# Altium project BUNE.PrjPcb
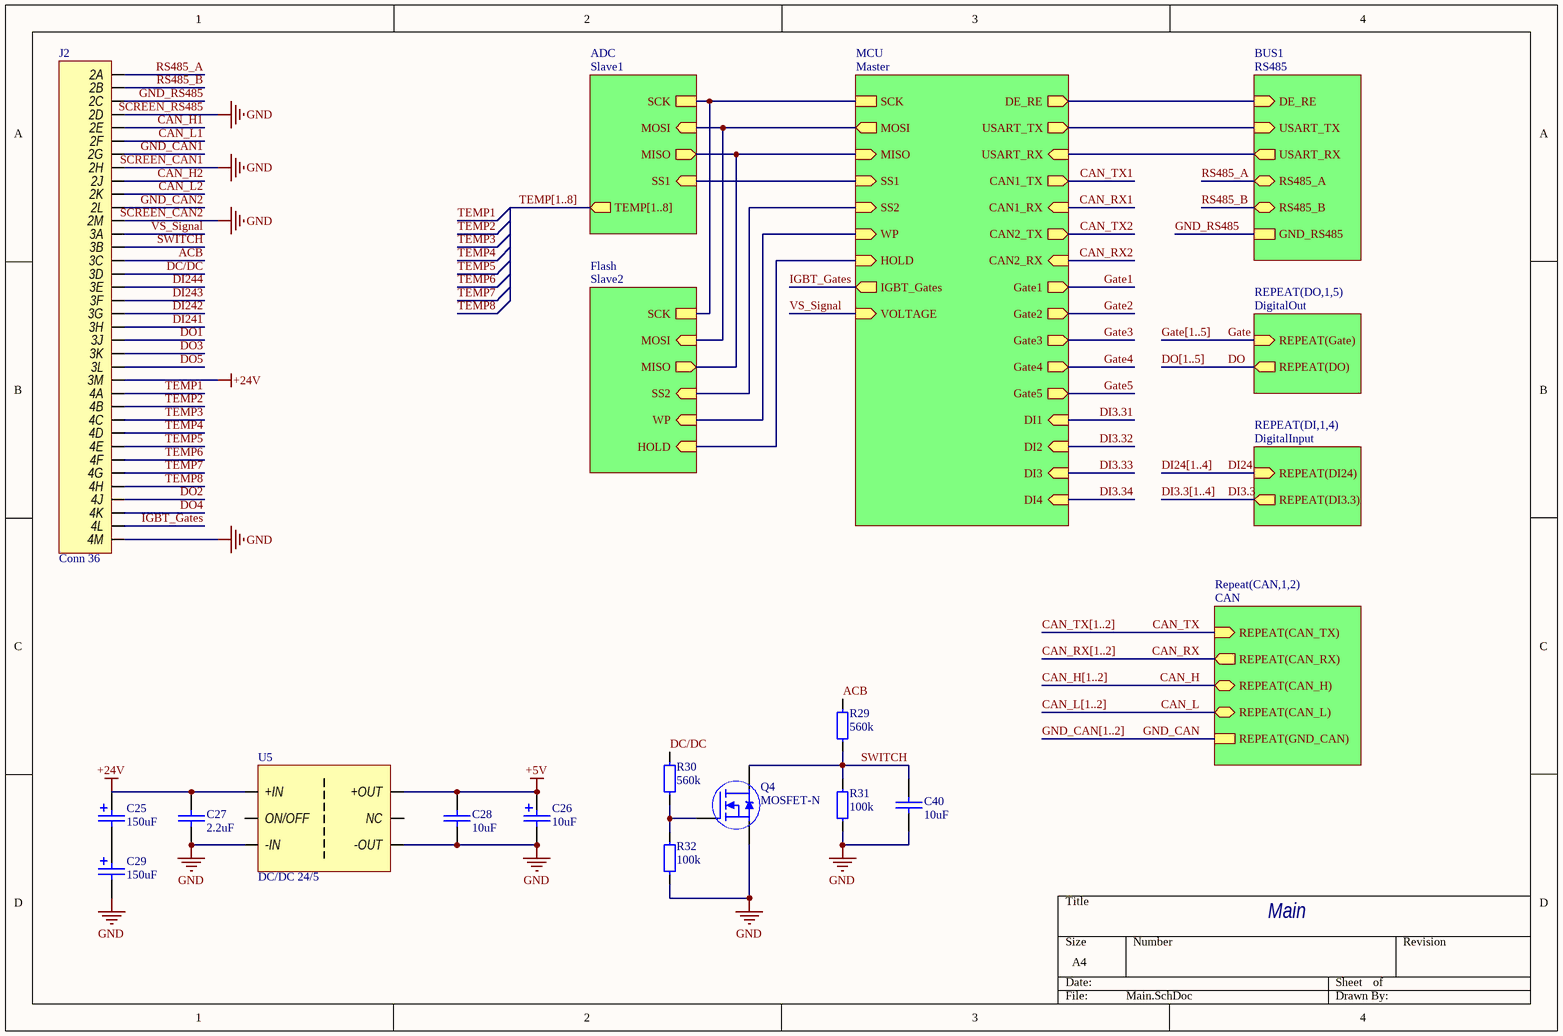
[diagram p0: Main.SchDoc]
8 sheets, 139 parts. Net scope: hierarchical (ports join the sheet entries above them; power ports are global).
Board file: BUNE.PcbDoc
Sheets:
  Main.SchDoc
    MCU = Master.SchDoc
    BUS1 = RS485.SchDoc
    CAN1 = CAN.SchDoc
    CAN2 = CAN.SchDoc
    ADC = Slave1.SchDoc
    Flash = Slave2.SchDoc
    DO1 = DigitalOut.SchDoc
    DO2 = DigitalOut.SchDoc
    DO3 = DigitalOut.SchDoc
    DO4 = DigitalOut.SchDoc
    DO5 = DigitalOut.SchDoc
    DI1 = DigitalInput.SchDoc
    DI2 = DigitalInput.SchDoc
    DI3 = DigitalInput.SchDoc
    DI4 = DigitalInput.SchDoc

## Sheet Main.SchDoc
size A4; SheetNumber: 1; SheetTotal: 8

### Parts
C25  150uF  [TANTAL_D_CASE]
C26  10uF  [TANTAL_C_CASE]
C27  2.2uF  [0603 Capicator]
C28  10uF  [0603 Capicator]
C29  150uF  [TANTAL_D_CASE]
C40  10uF  [0603 Capicator]
J2  Conn 36  [Molex_477320361]
Q4  MOSFET-N  [SOT-23]
R29  560k  [0603 Resistor]
R30  560k  [0603 Resistor]
R31  100k  [0603 Resistor]
R32  100k  [0603 Resistor]
U5  DC/DC 24/5  [VDRI10(6)]

### Sub-sheets
ADC = Slave1: TEMP[1..8] (out), MISO (out), SS1 (in), MOSI (in), SCK
BUS1 = RS485: USART_TX (in), USART_RX (out), DE_RE (in), RS485_A (bidir), RS485_B (bidir), GND_RS485
Flash = Slave2: MISO (out), SS2 (in), MOSI (in), SCK, WP (in), HOLD (in)
MCU = Master: DE_RE (out), USART_TX (out), USART_RX (in), CAN1_TX (out), CAN1_RX (in), CAN2_TX (out), CAN2_RX (in), VOLTAGE (in), IGBT_Gates (out), MISO (in), MOSI (out), SCK, WP (in), HOLD (in), SS1 (in), SS2 (in), Gate1 (out), Gate2 (out), Gate3 (out), Gate4 (out), Gate5 (out), DI1 (in), DI2 (in), DI3 (in), DI4 (in)
Repeat(CAN,1,2) = CAN: REPEAT(CAN_TX) (in), REPEAT(CAN_RX) (out), REPEAT(CAN_H) (bidir), REPEAT(CAN_L) (bidir), REPEAT(GND_CAN)
REPEAT(DI,1,4) = DigitalInput: REPEAT(DI24) (in), REPEAT(DI3.3) (out)
REPEAT(DO,1,5) = DigitalOut: REPEAT(Gate) (in), REPEAT(DO) (out)

### Nets
+5V: C26.2 C28.2 U5.9(+OUT)
+24V: C25.2 C27.2 J2.3M U5.16(+IN)
GND: C26.1 C27.1 C28.1 C29.1 C40.1 J2.2D J2.2H J2.2M J2.4M Q4.2(Source) R31.1 R32.1 U5.1(-IN) U5.10(-OUT)
ACB: J2.3C R29.2
CAN_H: sheet Repeat(CAN,1,2)/REPEAT(CAN_H)
CAN_H1: J2.2E
CAN_H2: J2.2J
CAN_L: sheet Repeat(CAN,1,2)/REPEAT(CAN_L)
CAN_L1: J2.2F
CAN_L2: J2.2K
CAN_RX: sheet Repeat(CAN,1,2)/REPEAT(CAN_RX)
CAN_TX: sheet Repeat(CAN,1,2)/REPEAT(CAN_TX)
DC/DC: J2.3D R30.2
DI3.3: sheet REPEAT(DI,1,4)/REPEAT(DI3.3)
DI24: sheet REPEAT(DI,1,4)/REPEAT(DI24)
DI241: J2.3H
DI242: J2.3G
DI243: J2.3F
DI244: J2.3E
DO: sheet REPEAT(DO,1,5)/REPEAT(DO)
DO1: J2.3J
DO2: J2.4J
DO3: J2.3K
DO4: J2.4K
DO5: J2.3L
Gate: sheet REPEAT(DO,1,5)/REPEAT(Gate)
GND_CAN: sheet Repeat(CAN,1,2)/REPEAT(GND_CAN)
GND_CAN1: J2.2G  [project net GND_CAN]
GND_CAN2: J2.2L  [project net GND_CAN]
GND_RS485: J2.2C ; sheet BUS1/GND_RS485
IGBT_Gates: J2.4L ; sheet MCU/IGBT_Gates
MISO: sheet MCU/MISO, sheet ADC/MISO, sheet Flash/MISO
MOSI: sheet MCU/MOSI, sheet ADC/MOSI, sheet Flash/MOSI
RS485_A: J2.2A ; sheet BUS1/RS485_A
RS485_B: J2.2B ; sheet BUS1/RS485_B
SCK: sheet MCU/SCK, sheet ADC/SCK, sheet Flash/SCK
SS1: sheet MCU/SS1, sheet ADC/SS1
SS2: sheet MCU/SS2, sheet Flash/SS2
SWITCH: C40.2 J2.3B Q4.3(Drain) R29.1 R31.2
TEMP1: J2.4A
TEMP2: J2.4B
TEMP3: J2.4C
TEMP4: J2.4D
TEMP5: J2.4E
TEMP6: J2.4F
TEMP7: J2.4G
TEMP8: J2.4H
VS_Signal: J2.3A ; sheet MCU/VOLTAGE
NetC25_1: C25.1 C29.2
NetQ4_1: Q4.1(Gate) R30.1 R32.2
NetU1_24: sheet MCU/WP, sheet Flash/WP
NetU1_25: sheet MCU/HOLD, sheet Flash/HOLD
NetU1_41: sheet MCU/DE_RE, sheet BUS1/DE_RE
NetU1_42: sheet MCU/USART_TX, sheet BUS1/USART_TX
NetU1_43: sheet MCU/USART_RX, sheet BUS1/USART_RX

Not connected (* = marked no-connect by the designer): U5 2(ON/OFF) 8(NC)

### Buses and harness runs
bus CAN_H[1..2]
bus CAN_L[1..2]
bus CAN_RX[1..2]
bus CAN_TX[1..2]
bus DI3.3[1..4]
bus DI24[1..4]
bus DO[1..5]
bus Gate[1..5]
bus GND_CAN[1..2]
bus TEMP[1..8] = sheet ADC/TEMP[1..8]

### Notes on the sheet
- (near J2) SCREEN_RS485
- (near J2) SCREEN_CAN1
- (near J2) SCREEN_CAN2
- Main

### Library data of the parts
C25 C29 = Cap Tantal 150uF (SMDD): TECAP, 150uF, 16V, case D, 10%; Part Number: 293D157X9010D2TE3; Manufacturer: Vishay; Type: Capacitor; ComponentLink1Description: Chip&Dip; ComponentLink1URL: https://www.chipdip.ru/product0/8018239339
C26 = Cap Tantal 10uF (SMDC): TECAP, 10uF, 35V, case C, 10%; Part Number: TECAP10/35VC10; Manufacturer: China; Type: Capacitor; ComponentLink1Description: Chip&Dip; ComponentLink1URL: https://www.chipdip.ru/product/tecap-10-mkf-35-v-tip-c-10
C27 = Cap 2.2uF (0603): 2.2uF X5R 50V 10% 0603; Manufacturer: Murata Manufacturing; Part Number: GRM188R61H225KE11D; Type: Capacitor; ComponentLink1Description: Chip&Dip; ComponentLink1URL: https://www.chipdip.ru/product/grm188r61h225ke11d-murata
C28 C40 = Cap 10uF (0603): 10uF X5R 25V 20% 0603; Manufacturer: Murata Manufacturing; Part Number: GRM188R61E106M; Type: Capacitor; ComponentLink1Description: Chip&Dip; ComponentLink1URL: https://www.chipdip.ru/product/grm188r61e106m
J2 = Conn 36 (Molex): Molec 36 pin PCB Header 477320361; Manufacturer: Molex; Type: Connector; Part Number: 477320361; ComponentLink1Description: ChipDip; ComponentLink1URL: https://www.chipdip.ru/product0/8004298252; ComponentLink2Description: Promelec; ComponentLink2URL: https://www.promelec.ru/product/427663/; ComponentLink3Description: Datasheet; ComponentLink3URL: https://static.chipdip.ru/lib/848/DOC011848025.pdf
Q4 = MOSFET-N [IRLML]: VDS 30V,  VGS Max ± 20V, RDS 27-40mΩ,; Part Number: IRLML0030TRPBF; Manufacturer: Infineon Technologies; Type: Transistor; ComponentLink1Description: DataSheet; ComponentLink1URL: https://static.chipdip.ru/lib/300/DOC000300382.pdf; ComponentLink2Description: Chip&Dip; ComponentLink2URL: https://www.chipdip.ru/product/irlml0030trpbf
R29 R30 = Res 560k (0603): 0.1W 0603 560k, 1%; Part Number: RC0603FR-07560KL; Manufacturer: Taiwan; Type: Resistor; ComponentLink1Description: Chip&Dip; ComponentLink1URL: https://www.chipdip.ru/product0/9000079778
R31 R32 = Res 100k (0603): 0.1W 0603 100k, 1%; Part Number: RC0603FR-07100KL; Manufacturer: Taiwan; Type: Resistor; ComponentLink1Description: Chip&Dip; ComponentLink1URL: https://www.chipdip.ru/product0/9000079760
U5 = VDRI10B05: DC/DC converter 24/5 10W; Manufacturer: Voltbricks; Part Number: VDRI10B05; Type: IC; ComponentLink2Description: Datasheet; ComponentLink2URL: https://support.voltbricks.ru/datasheets/VDRI10.pdf?1689593019

## Sheet Master.SchDoc
size A4; SheetNumber: 2; SheetTotal: 8
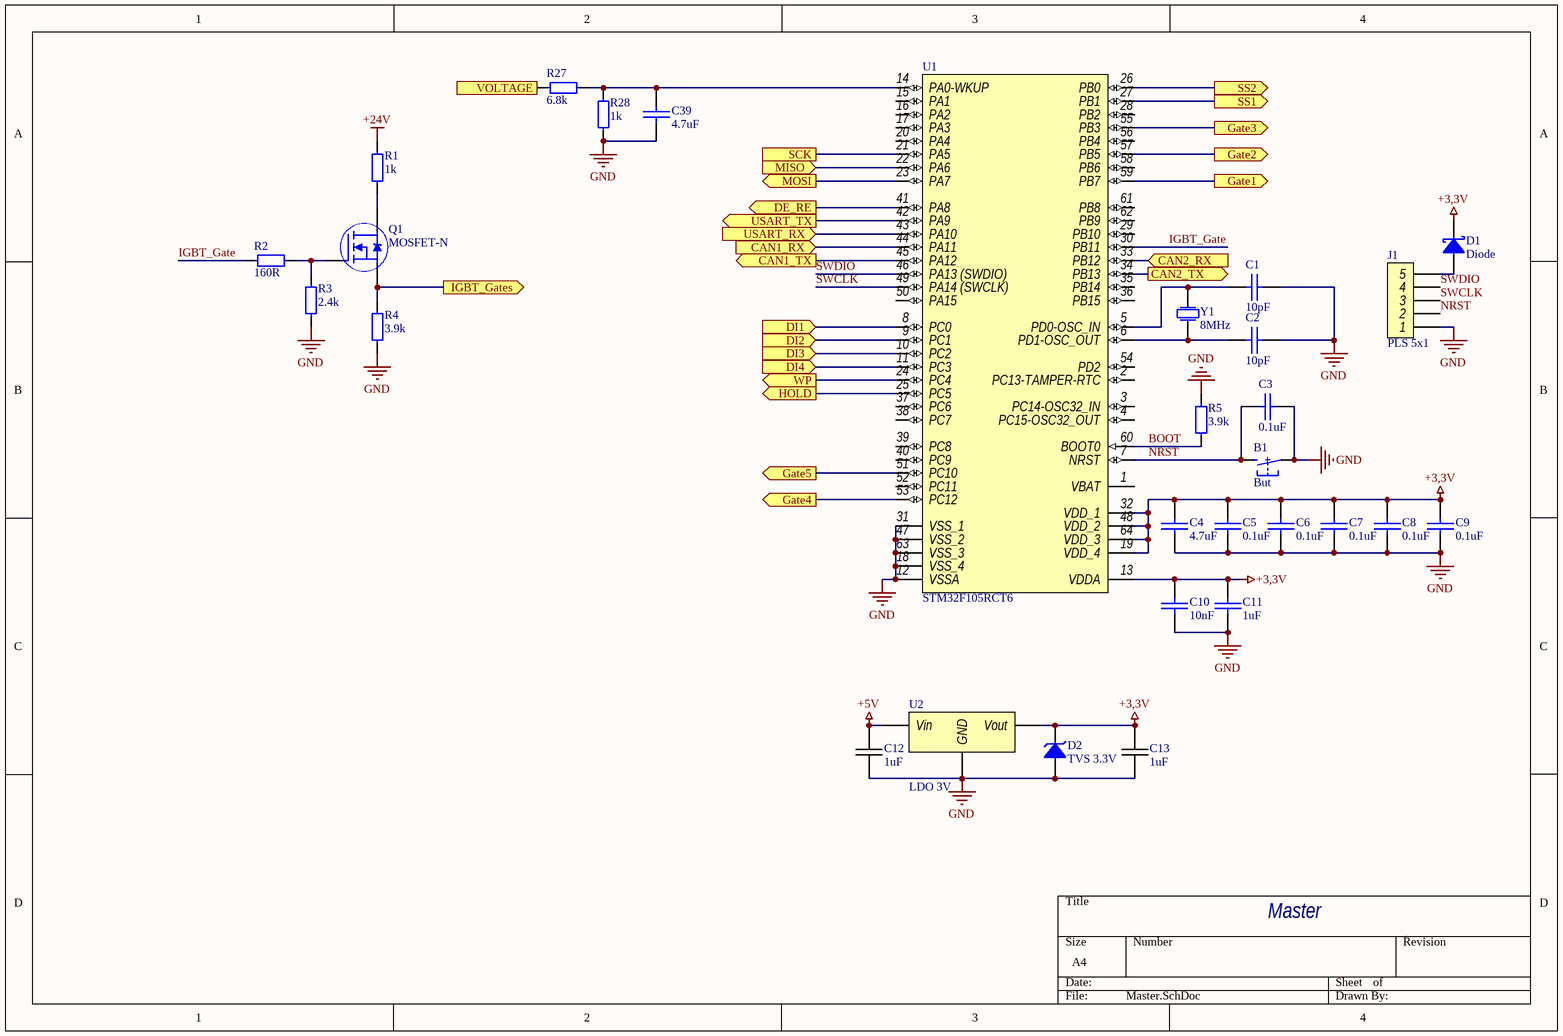
[diagram p1: Master.SchDoc]

### Parts
B1  But  [BUTTON 6x3.5]
C1  10pF  [0603 Capicator]
C2  10pF  [0603 Capicator]
C3  0.1uF  [0603 Capicator]
C4  4.7uF  [0603 Capicator]
C5  0.1uF  [0603 Capicator]
C6  0.1uF  [0603 Capicator]
C7  0.1uF  [0603 Capicator]
C8  0.1uF  [0603 Capicator]
C9  0.1uF  [0603 Capicator]
C10  10nF  [0603 Capicator]
C11  1uF  [0603 Capicator]
C12  1uF  [0603 Capicator]
C13  1uF  [0603 Capicator]
C39  4.7uF  [0603 Capicator]
D1  Diode  [sod-123]
D2  TVS 3.3V  [DO-216AA]
J1  PLS 5x1  [PLS 5x1]
Q1  MOSFET-N  [SOT-23]
R1  1k  [0603 Resistor]
R2  160R  [0603 Resistor]
R3  2.4k  [0603 Resistor]
R4  3.9k  [0603 Resistor]
R5  3.9k  [0603 Resistor]
R27  6.8k  [0603 Resistor]
R28  1k  [0603 Resistor]
U1  STM32F105RCT6  [LQFP64]
U2  LDO 3V  [SOT-23]
Y1  8MHz  [NX5032GA]

### Ports
CAN1_RX (in), CAN1_TX (out), CAN2_RX (in), CAN2_TX (out), DE_RE (out), DI1 (in), DI2 (in), DI3 (in), DI4 (in), Gate1 (out), Gate2 (out), Gate3 (out), Gate4 (out), Gate5 (out), HOLD (out), IGBT_Gates (out), MISO (in), MOSI (out), SCK, SS1 (out), SS2 (out), USART_RX (in), USART_TX (out), VOLTAGE (in), WP (out)

### Nets
+3,3V: C4.2 C5.2 C6.2 C7.2 C8.2 C9.2 C10.2 C11.2 C13.2 D1.2 D2.2 U1.13(VDDA) U1.19(VDD_4) U1.32(VDD_1) U1.48(VDD_2) U1.64(VDD_3) U2.2(Vout)
+5V: C12.2 U2.3(Vin)
+24V: R1.2
GND: B1.1 C1.2 C2.2 C3.2 C4.1 C5.1 C6.1 C7.1 C8.1 C9.1 C10.1 C11.1 C12.1 C13.1 C39.1 D2.1 J1.1 R3.1 R4.1 R5.2 R28.1 U1.12(VSSA) U1.18(VSS_4) U1.31(VSS_1) U1.47(VSS_2) U1.63(VSS_3) U2.1(GND)
BOOT: R5.1 U1.60(BOOT0)
CAN_RX1: U1.44(PA11) ; port CAN1_RX
CAN_RX2: U1.33(PB12) ; port CAN2_RX
CAN_TX1: U1.45(PA12) ; port CAN1_TX
CAN_TX2: U1.34(PB13) ; port CAN2_TX
DI3.31: U1.8(PC0) ; port DI1
DI3.32: U1.9(PC1) ; port DI2
DI3.33: U1.10(PC2) ; port DI3
DI3.34: U1.11(PC3) ; port DI4
Gate1: U1.59(PB7) ; port Gate1
Gate2: U1.57(PB5) ; port Gate2
Gate3: U1.55(PB3) ; port Gate3
Gate4: U1.53(PC12) ; port Gate4
Gate5: U1.51(PC10) ; port Gate5
IGBT_Gate: R2.1 U1.30(PB11)
IGBT_Gates: Q1.2(Source) R4.2 ; port IGBT_Gates
MISO: U1.22(PA6) ; port MISO
MOSI: U1.23(PA7) ; port MOSI
NRST: B1.2 C3.1 J1.2 U1.7(NRST)
SCK: U1.21(PA5) ; port SCK
SS1: U1.27(PB1) ; port SS1
SS2: U1.26(PB0) ; port SS2
SWCLK: J1.3 U1.49(PA14_(SWCLK))
SWDIO: J1.4 U1.46(PA13_(SWDIO))
VS_Signal: R27.2 ; port VOLTAGE
NetC1_1: C1.1 U1.5(PD0-OSC_IN) Y1.2
NetC2_1: C2.1 U1.6(PD1-OSC_OUT) Y1.1
NetC39_2: C39.2 R27.1 R28.2 U1.14(PA0-WKUP)
NetD1_1: D1.1 J1.5
NetQ1_1: Q1.1(Gate) R2.2 R3.2
NetQ1_3: Q1.3(Drain) R1.1
NetU1_24: U1.24(PC4) ; port WP
NetU1_25: U1.25(PC5) ; port HOLD
NetU1_41: U1.41(PA8) ; port DE_RE
NetU1_42: U1.42(PA9) ; port USART_TX
NetU1_43: U1.43(PA10) ; port USART_RX

Not connected (* = marked no-connect by the designer): U1 1(VBAT) 2(PC13-TAMPER-RTC) 3(PC14-OSC32_IN) 4(PC15-OSC32_OUT) 15(PA1) 16(PA2) 17(PA3) 20(PA4) 28(PB2) 29(PB10) 35(PB14) 36(PB15) 37(PC6) 38(PC7) 39(PC8) 40(PC9) 50(PA15) 52(PC11) 54(PD2) 56(PB4) 58(PB6) 61(PB8) 62(PB9)

### Notes on the sheet
- Master

### Library data of the parts
B1 = Button 2 Conn: Button 2 Conn SMD; Part Number: L-KLS7-TS3608-5.0-180; Manufacturer: KLS electronic co ltd; Type: Button; ComponentLink1Description: Chip&Dip; ComponentLink1URL: https://www.chipdip.ru/product/kls7-ts3608-5.0-180-td-02xa
C1 C2 = Cap 10pF (0603): 10pF NP0 50V 5% 0603; Manufacturer: Murata Manufacturing; Part Number: GRM1885C1H100JA01D; Type: Capacitor; ComponentLink1Description: Chip&Dip; ComponentLink1URL: https://www.chipdip.ru/product/grm1885c1h100j
C3 C5-C9 = Cap 0.1uF (0603): 0.1uF X7R 16V 10% 0603; Manufacturer: Murata Manufacturing; Part Number: GRM188R71C104KA01D; Type: Capacitor; ComponentLink1Description: Chip&Dip; ComponentLink1URL: https://www.chipdip.ru/product/grm188r71c104ka01d
C4 C39 = Cap 4.7uF (0603): 4.7uF X5R 25V 10% 0603; Manufacturer: Murata Manufacturing; Part Number: GRM188R61E475KE11D; Type: Capacitor; ComponentLink1Description: Chip&Dip; ComponentLink1URL: https://www.chipdip.ru/product0/9000348448
C10 = Cap 10nF (0603): 10nF X7R  100V 10% 0603; Manufacturer: Murata Manufacturing; Part Number: GRM188R72A103KA01D; Type: Capacitor; ComponentLink1Description: Chip&Dip; ComponentLink1URL: https://www.chipdip.ru/product/grm188r72a103ka01d
C11-C13 = Cap 1uF (0603): 1uF X5R 25V 10% 0603; Manufacturer: Murata Manufacturing; Part Number: GRM188R61E105KAADD; Type: Capacitor; ComponentLink1Description: Chip&Dip; ComponentLink1URL: https://www.chipdip.ru/product/grm188r61e105k
D1 = Diode Schottky (SOD-123): 0.5 A, Low Forward Voltage less than 385 mV, 400 mW Power Dissipation Package; Part Number: MBR0520L; Manufacturer: ON Semiconductor; Type: Diode; ComponentLink1Description: DataSheet; ComponentLink1URL: http://www.farnell.com/datasheets/1875336.pdf; ComponentLink2Description: Chip&Dip; ComponentLink2URL: https://www.chipdip.ru/product/mbr0520l
D2 = TVS Diode 3.3V [SM2T]: High peak pulse power: 200 W (10/1000 μs); Part Number: SM2T3V3A; Manufacturer: STMicroelectronics; Type: Diode; ComponentLink1Description: DataSheet; ComponentLink1URL: https://www.st.com/resource/en/datasheet/sm2t3v3a.pdf; ComponentLink2Description: Chip&Dip; ComponentLink2URL: https://www.chipdip.ru/product0/8283670575
J1 = Conn 5 (PLS): Header, 5-Pin
Q1 = MOSFET-N [IRLML]: as Q4 on sheet Main; ComponentLink1Description: DataSheet; ComponentLink1URL: https://static.chipdip.ru/lib/300/DOC000300382.pdf; ComponentLink2Description: Chip&Dip; ComponentLink2URL: https://www.chipdip.ru/product/irlml0030trpbf
R1 R28 = Res 1k (0603): 0.1W 0603 1k, 1%; Part Number: RC0603FR-071KL; Manufacturer: Taiwan; Type: Resistor; ComponentLink1Description: Chip&Dip; ComponentLink1URL: https://www.chipdip.ru/product0/9000079676
R2 = Res 160R (0603): 0.1W 0603 160R, 1%; Part Number: RC0603FR-07160RL; Manufacturer: Taiwan; Type: Resistor; ComponentLink1Description: Chip&Dip; ComponentLink1URL: https://www.chipdip.ru/product/0.1w-0603-160-om-1
R3 = Res 2.4k (0603): 0.1W 0603 2.4k, 1%; Part Number: RC0603FR-072K4L; Manufacturer: Taiwan; Type: Resistor; ComponentLink1Description: Chip&Dip; ComponentLink1URL: https://www.chipdip.ru/product0/9000079721
R4 R5 = Res 3.9k (0603): 0.1W 0603 3.9k, 1%; Part Number: RC0603FR-073K9L; Manufacturer: Taiwan; Type: Resistor; ComponentLink1Description: Chip&Dip; ComponentLink1URL: https://www.chipdip.ru/product0/9000079726
R27 = Res 6.8k (0603): 0.1W 0603 6.8k, 1%; Part Number: RC0603FR-076K8L; Manufacturer: Taiwan; Type: Resistor; ComponentLink1Description: Chip&Dip; ComponentLink1URL: https://www.chipdip.ru/product/0.1w-0603-6.8-kom-1
U1 = STM32F105RCT6: MCU ARM 256KB FLASH MEM 64-LQFP; Manufacturer: STMicroelectronics; Part Number: STM32F105RCT6; ComponentLink1Description: DataSheet; ComponentLink1URL: https://static.chipdip.ru/lib/375/DOC011375072.pdf; ComponentLink2Description: Chip&Dip; ComponentLink2URL: https://www.chipdip.ru/product/stm32f105rct6; Type: IC
U2 = LDO 3,3V [MCP]: MCP1702 Low Dropout Voltage Regulator. The input operating range is specifiedfrom 2.7V to 13.2V; Part Number: MCP1702T-3002E/CB; Manufacturer: Microchip; ComponentLink1Description: DataSheet; ComponentLink1URL: https://static.chipdip.ru/lib/986/DOC003986671.pdf; ComponentLink2Description: Chip&Dip; ComponentLink2URL: https://www.chipdip.ru/product/mcp1702t-3002e-cb-microchip
Y1 = Crystal 8MHz: Crystal NX5032GA; Manufacturer: Nihon Dempa Kogio (NDK); Part Number: NX5032GA-8MHz; Type: Crystal; ComponentLink1Description: Chip&Dip; ComponentLink1URL: https://www.chipdip.ru/product0/9000523954

## Sheet RS485.SchDoc
size A4; SheetNumber: 4; SheetTotal: 8
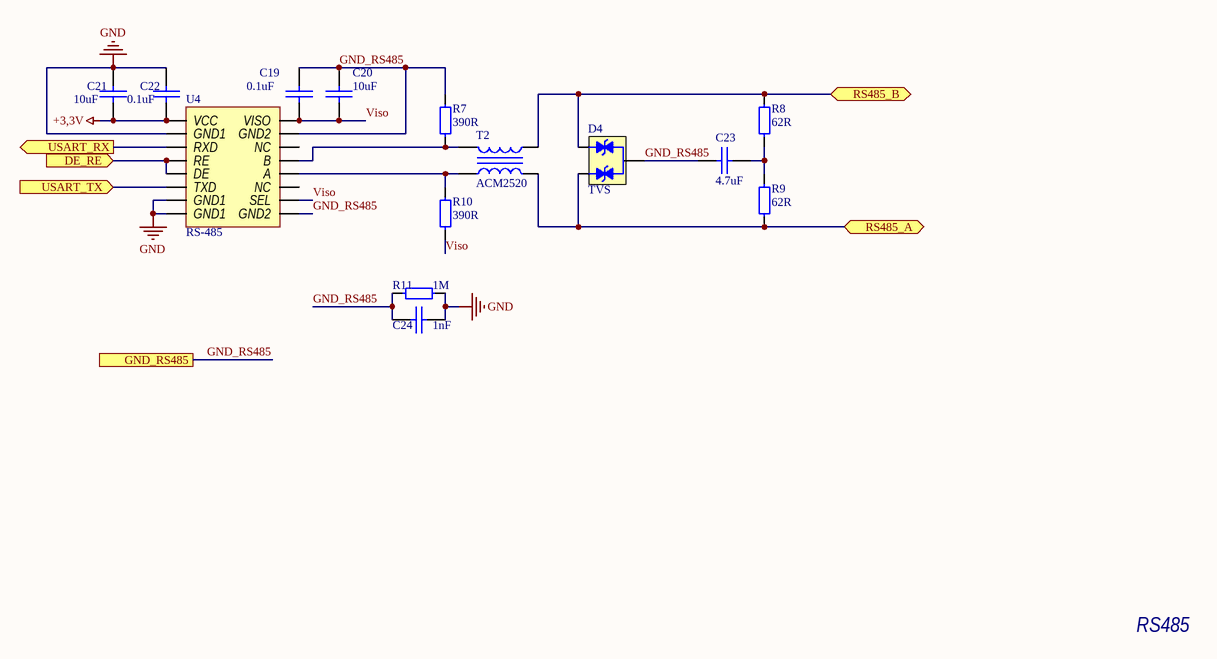
[diagram p2: RS485.SchDoc]

### Parts
C19  0.1uF  [0603 Capicator]
C20  10uF  [0603 Capicator]
C21  10uF  [0603 Capicator]
C22  0.1uF  [0603 Capicator]
C23  4.7uF  [0603 Capicator]
C24  1nF  [0603 Capicator]
D4  TVS  [SOT-23]
R7  390R  [1206 RESISTOR]
R8  62R  [0603 Resistor]
R9  62R  [0603 Resistor]
R10  390R  [1206 RESISTOR]
R11  1M  [0603 Resistor]
T2  ACM2520  [ACM2520]
U4  RS-485  [SOIC16W]

### Ports
DE_RE (in), GND_RS485, RS485_A (bidir), RS485_B (bidir), USART_RX (out), USART_TX (in)

### Nets
+3,3V: C21.2 C22.1 U4.1(VCC)
GND: C21.1 C22.2 C24.2 R11.2 U4.2(GND1) U4.7(GND1) U4.8(GND1)
GND_RS485: C19.2 C20.2 C23.2 C24.1 D4.3 R7.2 R11.1 U4.9(GND2) U4.15(GND2) ; port GND_RS485
RS485_A: D4.2 R9.1 T2.4 ; port RS485_A
RS485_B: D4.1 R8.2 T2.2 ; port RS485_B
Viso: C19.1 C20.1 R10.1 U4.10(SEL) U4.16(VISO)
NetC23_1: C23.1 R8.1 R9.2
NetR7_1: R7.1 T2.1 U4.13(B)
NetR10_2: R10.2 T2.3 U4.12(A)
NetU1_41: U4.4(RE) U4.5(DE) ; port DE_RE
NetU1_42: U4.6(TXD) ; port USART_TX
NetU1_43: U4.3(RXD) ; port USART_RX

Not connected (* = marked no-connect by the designer): U4 11(NC) 14(NC)

### Notes on the sheet
- RS485

### Library data of the parts
C19 C22 = Cap 0.1uF (0603): as C3 on sheet Master; ComponentLink1Description: Chip&Dip; ComponentLink1URL: https://www.chipdip.ru/product/grm188r71c104ka01d
C20 C21 = Cap 10uF (0603): as C28 on sheet Main; ComponentLink1Description: Chip&Dip; ComponentLink1URL: https://www.chipdip.ru/product/grm188r61e106m
C23 = Cap 4.7uF (0603): as C4 on sheet Master; ComponentLink1Description: Chip&Dip; ComponentLink1URL: https://www.chipdip.ru/product0/9000348448
C24 = Cap 1nF (0603): X7R 1nF 100V 10% 0603; Manufacturer: Murata Manufacturing; Part Number: GRM188R72A102KA01D; Type: Capacitor; ComponentLink1Description: Chip&Dip; ComponentLink1URL: https://www.chipdip.ru/product/grm188r72a102ka01d
D4 = TVS Diode Arrays: The SM24CANB TVS Diode Array is designed to protect automotive Controller Area Network (CAN) lines from damage due to electrostatic discharge (ESD), electrical fast transient (EFT), and other overvoltage transients.; Part Number: SM24CANB-02HTG; Manufacturer: Littelfuse; Type: Diode; ComponentLink1Description: DataSheet; ComponentLink1URL: https://m.littelfuse.com/~/media/electronics/datasheets/tvs_diode_arrays/littelfuse_tvs_diode_array_sm24canb_datasheet.pdf.pdf; ComponentLink2Description: Chip&Dip; ComponentLink2URL: https://www.chipdip.ru/product1/8001779022
R7 R10 = Res 390R (1206): 0.25W 1206 390R; Part Number: RC1206JR-07390KL; Manufacturer: Taiwan; Type: Resistor; ComponentLink1Description: Chip&Dip; ComponentLink1URL: https://www.chipdip.ru/product0/8023504304
R8 R9 = Res 62R (0603): 0.1W 0603 62R, 1%; Part Number: RC0603FR-0762RL; Manufacturer: Taiwan; Type: Resistor; ComponentLink1Description: Chip&Dip; ComponentLink1URL: https://www.chipdip.ru/product0/9000079611
R11 = Res 1M (0603): 0.1W 0603 1M, 1%; Part Number: RC0603FR-071ML; Manufacturer: Taiwan; Type: Resistor; ComponentLink1Description: Chip&Dip; ComponentLink1URL: https://www.chipdip.ru/product0/9000079784
T2 = ACM2520: Common mode filters / Automotive signal line (for power train/safety); Manufacturer: TDK; Part Number: ACM2520-301-2P-T002; Type: Inductor; ComponentLink1Description: DataSheet; ComponentLink1URL: https://product.tdk.com/system/files/dam/doc/product/emc/emc/cmf_cmc/catalog/cmf_commercial_signal_acm2520_en.pdf; ComponentLink2Description: ChipDip; ComponentLink2URL: https://www.chipdip.ru/product0/8008480337?ysclid=lw4t4jsj9a923851487
U4 = TDA51S485HC: Isolated RS-485 Half-Duplex tranciever; Manufacturer: Mornsun; Type: IC; Part Number: TDA51S485HC; ComponentLink1Description: ChipDip; ComponentLink1URL: https://www.chipdip.ru/product0/8009281357; ComponentLink2Description: Datasheet; ComponentLink2URL: https://www.mornsun-power.com/html/pdf/TDA51S485HC.html

## Sheet CAN.SchDoc
size A4; SheetNumber: 3; SheetTotal: 8
Used 2 times, as channels CAN1, CAN2. Parts and nets are listed once, with the designators drawn on the sheet.
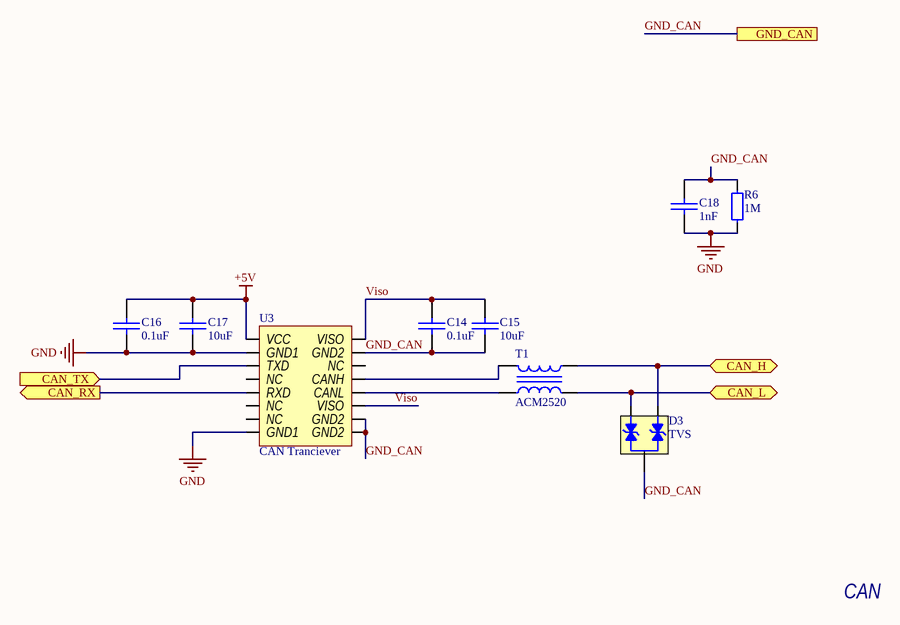
[diagram p3: CAN.SchDoc]

### Parts
C14  0.1uF  [0603 Capicator]
C15  10uF  [0603 Capicator]
C16  0.1uF  [0603 Capicator]
C17  10uF  [0603 Capicator]
C18  1nF  [0603 Capicator]
D3  TVS  [SOT-23]
R6  1M  [0603 Resistor]
T1  ACM2520  [ACM2520]
U3  CAN Tranciever  [SOIC16W]

### Ports
CAN_H (bidir), CAN_L (bidir), CAN_RX (out), CAN_TX (in), GND_CAN

### Nets
+5V: C16.2 C17.2 U3.1(VCC)
GND: C16.1 C17.1 C18.1 R6.1 U3.2(GND1) U3.8(GND1)
CAN_H: D3.1 T1.2 ; port CAN_H
CAN_L: D3.2 T1.4 ; port CAN_L
CAN_RX: U3.5(RXD) ; port CAN_RX
CAN_TX: U3.3(TXD) ; port CAN_TX
GND_CAN: C14.1 C15.1 C18.2 D3.3 R6.2 U3.9(GND2) U3.10(GND2) U3.15(GND2) ; port GND_CAN
Viso: C14.2 C15.2 U3.11(VISO) U3.16(VISO)
NetT1_1: T1.1 U3.13(CANH)
NetT1_3: T1.3 U3.12(CANL)

Not connected (* = marked no-connect by the designer): U3 4(NC) 6(NC) 7(NC) 14(NC)

### Channels
CAN1: designators end in _1; ports CAN_H=CAN_H1 CAN_L=CAN_L1 CAN_RX=CAN_RX1 CAN_TX=CAN_TX1 GND_CAN=GND_CAN
CAN2: designators end in _2; ports CAN_H=CAN_H2 CAN_L=CAN_L2 CAN_RX=CAN_RX2 CAN_TX=CAN_TX2 GND_CAN=GND_CAN

### Notes on the sheet
- CAN

### Library data of the parts
C14 C16 = Cap 0.1uF (0603): as C3 on sheet Master; ComponentLink1Description: Chip&Dip; ComponentLink1URL: https://www.chipdip.ru/product/grm188r71c104ka01d
C15 C17 = Cap 10uF (0603): as C28 on sheet Main; ComponentLink1Description: Chip&Dip; ComponentLink1URL: https://www.chipdip.ru/product/grm188r61e106m
C18 = Cap 1nF (0603): as C24 on sheet RS485; ComponentLink1Description: Chip&Dip; ComponentLink1URL: https://www.chipdip.ru/product/grm188r72a102ka01d
D3 = TVS Diode Arrays: as D4 on sheet RS485; Type: Diode; ComponentLink1Description: DataSheet; ComponentLink1URL: https://m.littelfuse.com/~/media/electronics/datasheets/tvs_diode_arrays/littelfuse_tvs_diode_array_sm24canb_datasheet.pdf.pdf; ComponentLink2Description: Chip&Dip; ComponentLink2URL: https://www.chipdip.ru/product1/8001779022
R6 = Res 1M (0603): as R11 on sheet RS485; Type: Resistor; ComponentLink1Description: Chip&Dip; ComponentLink1URL: https://www.chipdip.ru/product0/9000079784
T1 = ACM2520: as T2 on sheet RS485; ComponentLink1Description: DataSheet; ComponentLink1URL: https://product.tdk.com/system/files/dam/doc/product/emc/emc/cmf_cmc/catalog/cmf_commercial_signal_acm2520_en.pdf; ComponentLink2Description: ChipDip; ComponentLink2URL: https://www.chipdip.ru/product0/8008480337?ysclid=lw4t4jsj9a923851487
U3 = TDA51SCANHC: Isolated CAN Tranciever; Manufacturer: Mornsun Power; Type: IC; Part Number: TDA51SCANHC; ComponentLink1Description: ChipDip; ComponentLink1URL: https://www.chipdip.ru/product0/8024219767; ComponentLink2Description: Datasheet; ComponentLink2URL: https://static.chipdip.ru/lib/623/DOC041623283.pdf

## Sheet Slave1.SchDoc
size A4; SheetNumber: 5; SheetTotal: 8
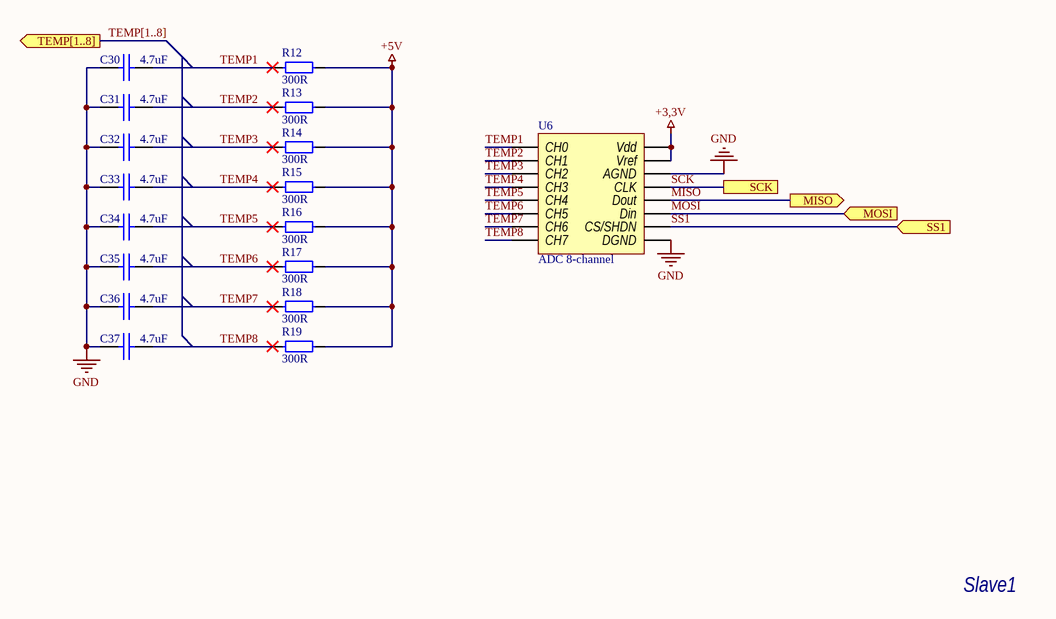
[diagram p4: Slave1.SchDoc]

### Parts
C30  4.7uF  [0603 Capicator]
C31  4.7uF  [0603 Capicator]
C32  4.7uF  [0603 Capicator]
C33  4.7uF  [0603 Capicator]
C34  4.7uF  [0603 Capicator]
C35  4.7uF  [0603 Capicator]
C36  4.7uF  [0603 Capicator]
C37  4.7uF  [0603 Capicator]
R12  300R  [0603 Resistor]
R13  300R  [0603 Resistor]
R14  300R  [0603 Resistor]
R15  300R  [0603 Resistor]
R16  300R  [0603 Resistor]
R17  300R  [0603 Resistor]
R18  300R  [0603 Resistor]
R19  300R  [0603 Resistor]
U6  ADC 8-channel  [SOIC-16]

### Ports
MISO (out), MOSI (in), SCK, SS1 (in), TEMP[1..8] (out)

### Nets
+3,3V: U6.15(Vref) U6.16(Vdd)
+5V: R12.2 R13.2 R14.2 R15.2 R16.2 R17.2 R18.2 R19.2
GND: C30.1 C31.1 C32.1 C33.1 C34.1 C35.1 C36.1 C37.1 U6.9(DGND) U6.14(AGND)
MISO: U6.12(Dout) ; port MISO
MOSI: U6.11(Din) ; port MOSI
SCK: U6.13(CLK) ; port SCK
SS1: U6.10(CS/SHDN) ; port SS1
TEMP1: C30.2 R12.1 U6.1(CH0)
TEMP2: C31.2 R13.1 U6.2(CH1)
TEMP3: C32.2 R14.1 U6.3(CH2)
TEMP4: C33.2 R15.1 U6.4(CH3)
TEMP5: C34.2 R16.1 U6.5(CH4)
TEMP6: C35.2 R17.1 U6.6(CH5)
TEMP7: C36.2 R18.1 U6.7(CH6)
TEMP8: C37.2 R19.1 U6.8(CH7)

### Buses and harness runs
bus TEMP[1..8] = port TEMP[1..8]

### Notes on the sheet
- Slave1

### Library data of the parts
C30-C37 = Cap 4.7uF (0603): as C4 on sheet Master; ComponentLink1Description: Chip&Dip; ComponentLink1URL: https://www.chipdip.ru/product0/9000348448
R12-R19 = Res 300R (0603): 0.1W 0603 300R, 1%; Part Number: RC0603FR-07360RL; Manufacturer: Taiwan; Type: Resistor; ComponentLink1Description: Chip&Dip; ComponentLink1URL: https://www.chipdip.ru/product0/9000079629
U6 = MCP3008-I/SL: A/D converter with SPI serial interface; Manufacturer: Microchip; Part Number: MCP3008-I/SL; Type: IC; ComponentLink1Description: ChipDip; ComponentLink1URL: https://www.chipdip.ru/product/mcp3008-i-sl; ComponentLink2Description: Datadheet; ComponentLink2URL: https://static.chipdip.ru/lib/527/DOC011527685.pdf

## Sheet Slave2.SchDoc
size A4; SheetNumber: 6; SheetTotal: 8
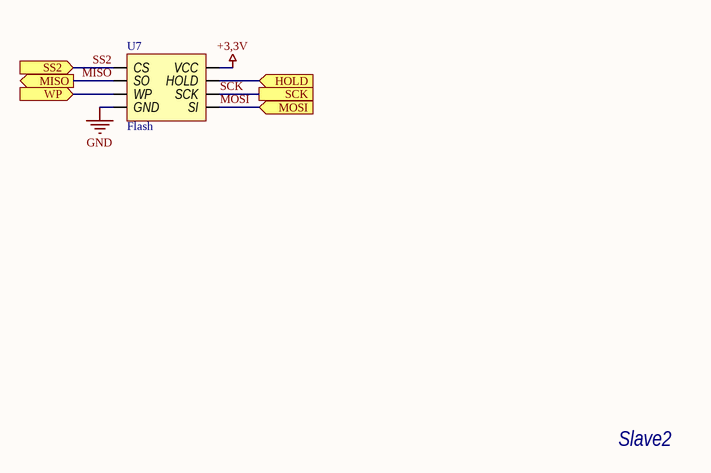
[diagram p5: Slave2.SchDoc]

### Parts
U7  Flash  [SOIC-8-0]

### Ports
HOLD (in), MISO (out), MOSI (in), SCK, SS2 (in), WP (in)

### Nets
+3,3V: U7.8(VCC)
GND: U7.4(GND)
MISO: U7.2(SO) ; port MISO
MOSI: U7.5(SI) ; port MOSI
SCK: U7.6(SCK) ; port SCK
SS2: U7.1(CS) ; port SS2
NetU1_24: U7.3(WP) ; port WP
NetU1_25: U7.7(HOLD) ; port HOLD

### Notes on the sheet
- Slave2

### Library data of the parts
U7 = AT25DF32A-SH-T: 32MBit Flash memore 100 MHz; Manufacturer: Adesto Technologies; ComponentLink1Description: Dayasheet; ComponentLink1URL: https://static.chipdip.ru/lib/314/DOC000314047.pdf; ComponentLink2Description: ChipDip; ComponentLink2URL: https://www.chipdip.ru/product/at25df321a-sh-t?from=suggest_product; Type: IC; Part Number: AT25DF32A-SH-T

## Sheet DigitalOut.SchDoc
size A4; SheetNumber: 7; SheetTotal: 8
Used 5 times, as channels DO1, DO2, DO3, DO4, DO5. Parts and nets are listed once, with the designators drawn on the sheet.
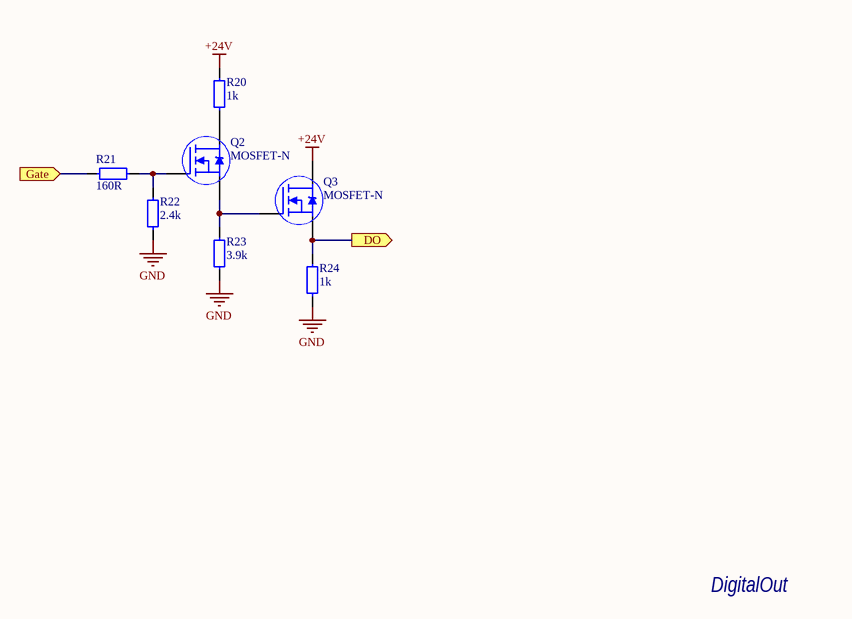
[diagram p6: DigitalOut.SchDoc]

### Parts
Q2  MOSFET-N  [SOT-23]
Q3  MOSFET-N  [SOT-23]
R20  1k  [0603 Resistor]
R21  160R  [0603 Resistor]
R22  2.4k  [0603 Resistor]
R23  3.9k  [0603 Resistor]
R24  1k  [0603 Resistor]

### Ports
DO (out), Gate (in)

### Nets
+24V: Q3.3(Drain) R20.2
GND: R22.1 R23.1 R24.1
DO: Q3.2(Source) R24.2 ; port DO
Gate: R21.1 ; port Gate
NetQ2_1: Q2.1(Gate) R21.2 R22.2
NetQ2_2: Q2.2(Source) Q3.1(Gate) R23.2
NetQ2_3: Q2.3(Drain) R20.1

### Channels
DO1: designators end in _1; ports DO=DO1 Gate=Gate1
DO2: designators end in _2; ports DO=DO2 Gate=Gate2
DO3: designators end in _3; ports DO=DO3 Gate=Gate3
DO4: designators end in _4; ports DO=DO4 Gate=Gate4
DO5: designators end in _5; ports DO=DO5 Gate=Gate5

### Notes on the sheet
- DigitalOut

### Library data of the parts
Q2 Q3 = MOSFET-N [IRLML]: as Q4 on sheet Main; ComponentLink1Description: DataSheet; ComponentLink1URL: https://static.chipdip.ru/lib/300/DOC000300382.pdf; ComponentLink2Description: Chip&Dip; ComponentLink2URL: https://www.chipdip.ru/product/irlml0030trpbf
R20 R24 = Res 1k (0603): as R1 on sheet Master; Type: Resistor; ComponentLink1Description: Chip&Dip; ComponentLink1URL: https://www.chipdip.ru/product0/9000079676
R21 = Res 160R (0603): as R2 on sheet Master; Type: Resistor; ComponentLink1Description: Chip&Dip; ComponentLink1URL: https://www.chipdip.ru/product/0.1w-0603-160-om-1
R22 = Res 2.4k (0603): as R3 on sheet Master; Type: Resistor; ComponentLink1Description: Chip&Dip; ComponentLink1URL: https://www.chipdip.ru/product0/9000079721
R23 = Res 3.9k (0603): as R4 on sheet Master; Type: Resistor; ComponentLink1Description: Chip&Dip; ComponentLink1URL: https://www.chipdip.ru/product0/9000079726

## Sheet DigitalInput.SchDoc
size A4; SheetNumber: 8; SheetTotal: 8
Used 4 times, as channels DI1, DI2, DI3, DI4. Parts and nets are listed once, with the designators drawn on the sheet.
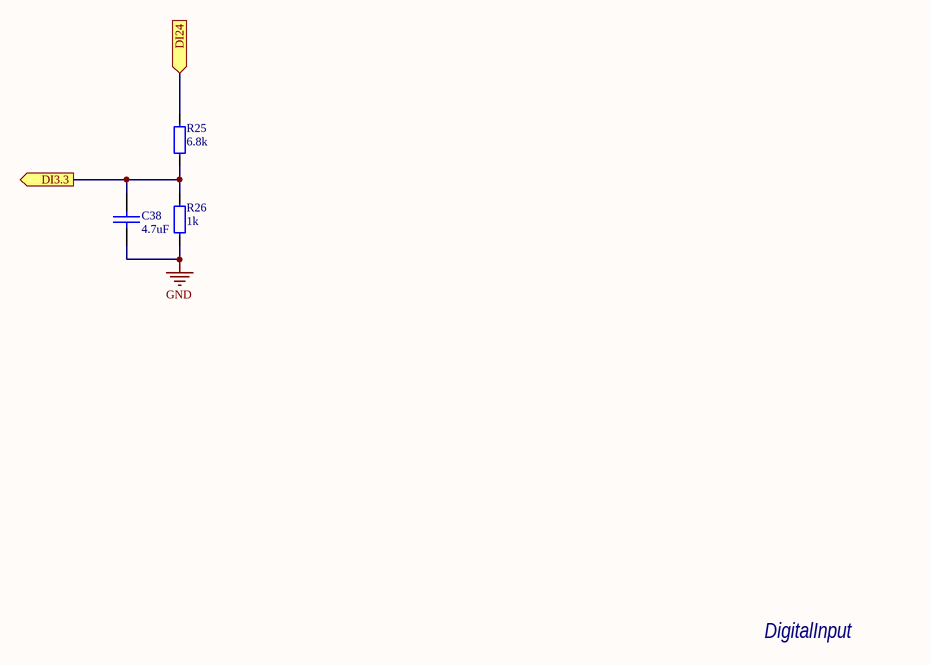
[diagram p7: DigitalInput.SchDoc]

### Parts
C38  4.7uF  [0603 Capicator]
R25  6.8k  [0603 Resistor]
R26  1k  [0603 Resistor]

### Ports
DI3.3 (out), DI24 (in)

### Nets
GND: C38.1 R26.1
DI3.3: C38.2 R25.1 R26.2 ; port DI3.3
DI24: R25.2 ; port DI24

### Channels
DI1: designators end in _1; ports DI3.3=DI3.31 DI24=DI241
DI2: designators end in _2; ports DI3.3=DI3.32 DI24=DI242
DI3: designators end in _3; ports DI3.3=DI3.33 DI24=DI243
DI4: designators end in _4; ports DI3.3=DI3.34 DI24=DI244

### Notes on the sheet
- DigitalInput

### Library data of the parts
C38 = Cap 4.7uF (0603): as C4 on sheet Master; ComponentLink1Description: Chip&Dip; ComponentLink1URL: https://www.chipdip.ru/product0/9000348448
R25 = Res 6.8k (0603): as R27 on sheet Master; Type: Resistor; ComponentLink1Description: Chip&Dip; ComponentLink1URL: https://www.chipdip.ru/product/0.1w-0603-6.8-kom-1
R26 = Res 1k (0603): as R1 on sheet Master; Type: Resistor; ComponentLink1Description: Chip&Dip; ComponentLink1URL: https://www.chipdip.ru/product0/9000079676

## Nets that join several sheets
+3,3V: Master (17 pins), RS485 (C21.2 C22.1 U4.1), Slave1 (U6.15 U6.16), Slave2 (U7.8)
+5V: Main (C26.2 C28.2 U5.9), Master (C12.2 U2.3), CAN1 (C16_1.2 C17_1.2 U3_1.1), CAN2 (C16_2.2 C17_2.2 U3_2.1), Slave1 (8 pins)
+24V: Main (C25.2 C27.2 J2.3M U5.16), Master (R1.2), DO1 (Q3_1.3 R20_1.2), DO2 (Q3_2.3 R20_2.2), DO3 (Q3_3.3 R20_3.2), DO4 (Q3_4.3 R20_4.2), DO5 (Q3_5.3 R20_5.2)
GND: Main (14 pins), Master (27 pins), RS485 (7 pins), CAN1 (6 pins), CAN2 (6 pins), Slave1 (10 pins), Slave2 (U7.4), DO1 (R22_1.1 R23_1.1 R24_1.1), DO2 (R22_2.1 R23_2.1 R24_2.1), DO3 (R22_3.1 R23_3.1 R24_3.1), DO4 (R22_4.1 R23_4.1 R24_4.1), DO5 (R22_5.1 R23_5.1 R24_5.1), DI1 (C38_1.1 R26_1.1), DI2 (C38_2.1 R26_2.1), DI3 (C38_3.1 R26_3.1), DI4 (C38_4.1 R26_4.1)
CAN_H1: Main (J2.2E), CAN1 (D3_1.1 T1_1.2)
CAN_H2: Main (J2.2J), CAN2 (D3_2.1 T1_2.2)
CAN_L1: Main (J2.2F), CAN1 (D3_1.2 T1_1.4)
CAN_L2: Main (J2.2K), CAN2 (D3_2.2 T1_2.4)
CAN_RX1: Master (U1.44), CAN1 (U3_1.5)
CAN_RX2: Master (U1.33), CAN2 (U3_2.5)
CAN_TX1: Master (U1.45), CAN1 (U3_1.3)
CAN_TX2: Master (U1.34), CAN2 (U3_2.3)
DI3.31: Master (U1.8), DI1 (C38_1.2 R25_1.1 R26_1.2)
DI3.32: Master (U1.9), DI2 (C38_2.2 R25_2.1 R26_2.2)
DI3.33: Master (U1.10), DI3 (C38_3.2 R25_3.1 R26_3.2)
DI3.34: Master (U1.11), DI4 (C38_4.2 R25_4.1 R26_4.2)
DI241: Main (J2.3H), DI1 (R25_1.2)
DI242: Main (J2.3G), DI2 (R25_2.2)
DI243: Main (J2.3F), DI3 (R25_3.2)
DI244: Main (J2.3E), DI4 (R25_4.2)
DO1: Main (J2.3J), DO1 (Q3_1.2 R24_1.2)
DO2: Main (J2.4J), DO2 (Q3_2.2 R24_2.2)
DO3: Main (J2.3K), DO3 (Q3_3.2 R24_3.2)
DO4: Main (J2.4K), DO4 (Q3_4.2 R24_4.2)
DO5: Main (J2.3L), DO5 (Q3_5.2 R24_5.2)
Gate1: Master (U1.59), DO1 (R21_1.1)
Gate2: Master (U1.57), DO2 (R21_2.1)
Gate3: Master (U1.55), DO3 (R21_3.1)
Gate4: Master (U1.53), DO4 (R21_4.1)
Gate5: Master (U1.51), DO5 (R21_5.1)
GND_CAN: Main (J2.2G), CAN1 (8 pins)
GND_CAN: Main (J2.2L), CAN2 (8 pins)
GND_RS485: Main (J2.2C), RS485 (9 pins)
IGBT_Gates: Main (J2.4L), Master (Q1.2 R4.2)
MISO: Master (U1.22), Slave1 (U6.12), Slave2 (U7.2)
MOSI: Master (U1.23), Slave1 (U6.11), Slave2 (U7.5)
NetU1_24: Master (U1.24), Slave2 (U7.3)
NetU1_25: Master (U1.25), Slave2 (U7.7)
NetU1_41: Master (U1.41), RS485 (U4.4 U4.5)
NetU1_42: Master (U1.42), RS485 (U4.6)
NetU1_43: Master (U1.43), RS485 (U4.3)
RS485_A: Main (J2.2A), RS485 (D4.2 R9.1 T2.4)
RS485_B: Main (J2.2B), RS485 (D4.1 R8.2 T2.2)
SCK: Master (U1.21), Slave1 (U6.13), Slave2 (U7.6)
SS1: Master (U1.27), Slave1 (U6.10)
SS2: Master (U1.26), Slave2 (U7.1)
TEMP1: Main (J2.4A), Slave1 (C30.2 R12.1 U6.1)
TEMP2: Main (J2.4B), Slave1 (C31.2 R13.1 U6.2)
TEMP3: Main (J2.4C), Slave1 (C32.2 R14.1 U6.3)
TEMP4: Main (J2.4D), Slave1 (C33.2 R15.1 U6.4)
TEMP5: Main (J2.4E), Slave1 (C34.2 R16.1 U6.5)
TEMP6: Main (J2.4F), Slave1 (C35.2 R17.1 U6.6)
TEMP7: Main (J2.4G), Slave1 (C36.2 R18.1 U6.7)
TEMP8: Main (J2.4H), Slave1 (C37.2 R19.1 U6.8)
VS_Signal: Main (J2.3A), Master (R27.2)